# EAGLE design flip-flop (EAGLE 7.1.0)
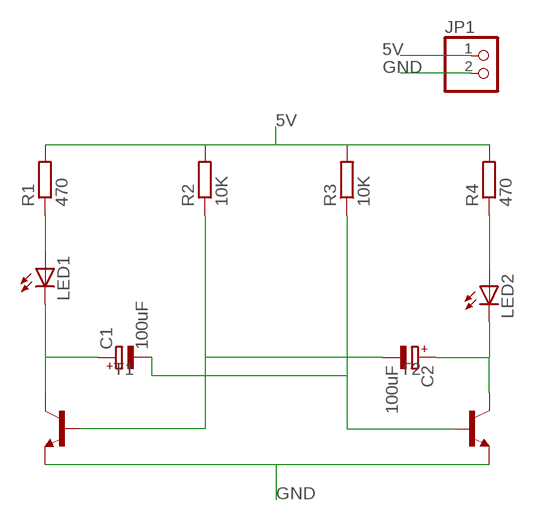
[diagram p0: schematic, sheet 1]

## Parts
C1  100uF  CPOL-EUE2.5-6  [E2,5-6]
C2  100uF  CPOL-EUE2.5-6  [E2,5-6]
JP1  PINHD-1X2  [1X02]
LED1  LED3MM  [LED3MM]
LED2  LED3MM  [LED3MM]
R1  470  R-EU_0207/7  [0207/7]
R2  10K  R-EU_0207/7  [0207/7]
R3  10K  R-EU_0207/7  [0207/7]
R4  470  R-EU_0207/7  [0207/7]
T1  BC547-NPN-TO92-CBE  [TO92-CBE]
T2  BC547-NPN-TO92-CBE  [TO92-CBE]

## Nets
5V: JP1.1 R1.2 R2.2 R3.2 R4.2
GND: JP1.2 T1.E T2.E
N$2: LED1.A R1.1
N$3: LED2.A R4.1
N$4: C1.+ LED1.K(C) T1.C
N$5: C2.+ LED2.K(C) T2.C
N$6: C2.- R2.1 T1.B
N$7: C1.- R3.1 T2.B

## Library data of the parts
C1 C2 = rcl:CPOL-EU: POLARIZED CAPACITOR, European symbol
JP1 = pinhead:PINHD-1X2: PIN HEADER
LED1 LED2 = led:LED: LED OSRAM: - CHIPLED LG R971, LG N971, LY N971, LG Q971, LY Q971, LO R971, LY R971 LH N974, LH R974 LS Q976, LO Q976, LY Q976 LO Q996 - Hyper CHIPLED LW Q18S LB Q993, LB Q99A, LB R99A - SideLED LS A670, LO A670, LY A670, LG A670, LP A670 LB A673, LV A673, LT A673, LW A673 LH A674 LY A675 LS A676, LA A676, LO A676, LY A676, LW A676 LS A679, LY A679, LG A679 - Hyper Micro SIDELED® LS Y876, LA Y876, LO Y876, LY Y876 LT Y87S - SmartLED LW L88C, LW L88S LB L89C, LB L89S, LG L890 LS L89K, LO L89K, LY L89K LS L896, LA L896, LO L896, LY L896 - TOPLED LS T670, LO T670, LY T670, LG T670, LP T670 LSG T670, LSP T670, LSY T670, LOP T670, LYG T670 LG T671, LOG T671, LSG T671 LB T673, LV T673, LT T673, LW T673 LH T674 LS T676, LA T676, LO T676, LY T676, LB T676, LH T676, LSB T676, LW T676 LB T67C, LV T67C, LT T67C, LS T67K, LO T67K, LY T67K, LW E67C LS E67B, LA E67B, LO E67B, LY E67B, LB E67C, LV E67C, LT E67C LW T67C LS T679, LY T679, LG T679 LS T770, LO T770, LY T770, LG T770, LP T770 LB T773, LV T773, LT T773, LW T773 LH T774 LS E675, LA E675, LY E675, LS T675 LS T776, LA T776, LO T776, LY T776, LB T776 LHGB T686 LT T68C, LB T68C - Hyper Mini TOPLED® LB M676 - Mini TOPLED Santana® LG M470 LS M47K, LO M47K, LY M47K Source: http://www.osram.convergy.de LUXEON: - LUMILED® LXK2-PW12-R00, LXK2-PW12-S00, LXK2-PW14-U00, LXK2-PW14-V00 LXK2-PM12-R00, LXK2-PM12-S00, LXK2-PM14-U00 LXK2-PE12-Q00, LXK2-PE12-R00, LXK2-PE12-S00, LXK2-PE14-T00, LXK2-PE14-U00 LXK2-PB12-K00, LXK2-PB12-L00, LXK2-PB12-M00, LXK2-PB14-N00, LXK2-PB14-P00, LXK2-PB14-Q00 LXK2-PR12-L00, LXK2-PR12-M00, LXK2-PR14-Q00, LXK2-PR14-R00 LXK2-PD12-Q00, LXK2-PD12-R00, LXK2-PD12-S00 LXK2-PH12-R00, LXK2-PH12-S00 LXK2-PL12-P00, LXK2-PL12-Q00, LXK2-PL12-R00 Source: www.luxeon.com KINGBRIGHT: KA-3528ASYC Source: www.kingbright.com
R1-R4 = rcl:R-EU_: RESISTOR, European symbol
T1 T2 = transistor:*-NPN-: NPN Transistror BF959 corrected 2008.03.06

## Board
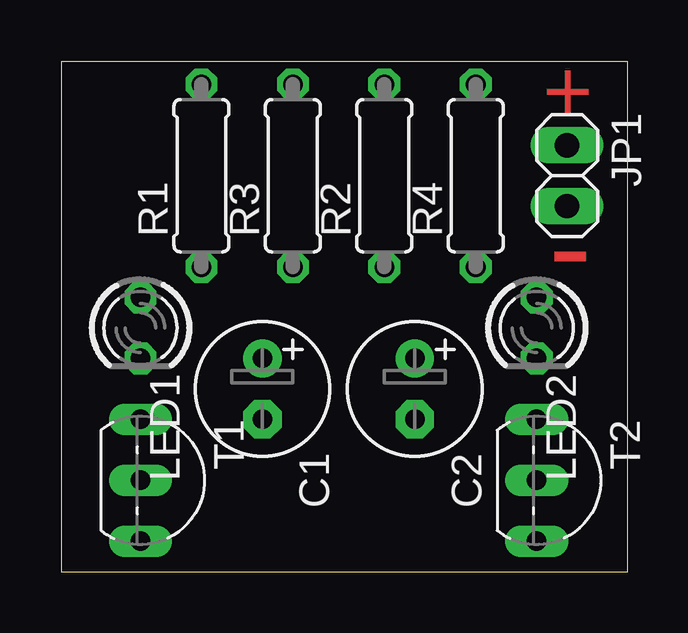
[diagram p1: board, top side]
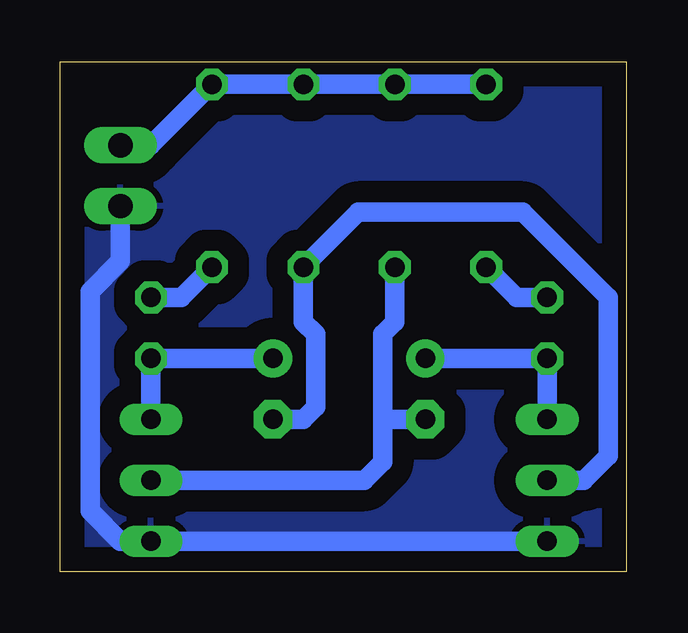
[diagram p2: board, bottom side, seen from below]

Size 23.6 x 21.26 mm. Coordinates in mm from the lower left corner, seen from the top.
Outline: 0,0 23.6,0 23.6,21.26 0,21.26 0,0
Copper layers (1*16): Top 0.035mm / dielectric 1.5mm / Bottom 0.035mm
Design rules "default *": minimum track width 10mil, minimum drill 24mil, track to track 35mil, track to pad 35mil, pad to pad 8mil, via to via 8mil, smd to smd 8mil, copper to edge 40mil, drill to drill 8mil, minimum pad ring 10mil, minimum via ring 8mil, stop-mask expansion 4mil, vias tented up to drill 0mil, thermal gap 10mil

### Footprints (pad centres in the part's own frame; a part is rotated, then mirrored left to right if it is on the bottom)
E2,5-6 = drill 0.813 pad 1.6: + -1.27,0 | drill 0.813 pad 1.6 octagon: - 1.27,0
1X02 = drill 1.016 long: 1 -1.27,0; 2 1.27,0
LED3MM = drill 0.813 octagon: A -1.27,0; K 1.27,0
0207/7 = drill 0.813 octagon: 1 -3.81,0; 2 3.81,0
TO92-CBE = drill 0.813 long: B 0,0; C -2.54,0; E 2.54,0

### Placement (x,y rotation side)
C1  8.38,7.62 270 top
C2  14.73,7.62 270 top
JP1  21.08,16.51 270 top
LED1  3.3,10.16 270 top
LED2  19.81,10.16 270 top
R1  5.84,16.51 90 top
R2  13.46,16.51 90 top
R3  9.65,16.51 90 top
R4  17.27,16.51 90 top
T1  3.3,3.81 270 top
T2  19.81,3.81 270 top

### Tracks (layer width: path | path; a pad name or v marks a point on that pad's centre or on a via)
5V
  Bottom 0.813: R1.2 R3.2 R2.2 R4.2 19.81,17.78 JP1.1
GND
  Bottom 0.813: T1.E T2.E 21.08,1.27 22.35,2.54 22.35,11.68 21.08,12.95 JP1.2
  pour Bottom: 0,21.34 23.62,21.34 23.62,0 0,0
N$2
  Bottom 0.813: LED1.A 4.57,11.43 R1.1
N$3
  Bottom 0.813: LED2.A 18.54,11.43 R4.1
N$4
  Bottom 0.813: C1.+ LED1.K T1.C
N$5
  Bottom 0.813: C2.+ LED2.K T2.C
N$6
  Bottom 0.813: C2.- 13.46,6.35 12.95,6.86 12.95,9.91 13.46,10.41 R2.1 11.18,14.99 4.32,14.99 0.76,11.43 0.76,4.83 1.78,3.81 T1.B
N$7
  Bottom 0.813: R3.1 9.65,10.41 10.16,9.91 10.16,6.35 | 10.16,6.35 10.16,4.57 10.92,3.81 T2.B | C1.- 10.16,6.35

### Text on the board
Top: + | -